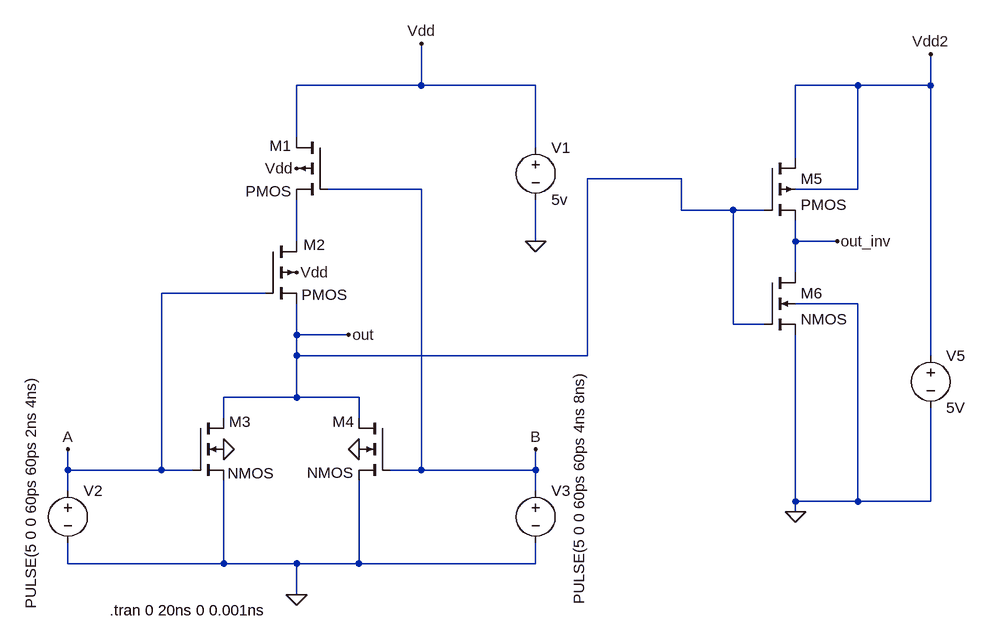
[diagram p0: schematic OR.asc]
OR.asc, the LTspice schematic file:
Version 4
SHEET 1 1400 752
WIRE 512 -80 512 -144
WIRE 512 -80 320 -80
WIRE 688 -80 512 -80
WIRE 1184 -80 1088 -80
WIRE 1296 -80 1296 -128
WIRE 1296 -80 1184 -80
WIRE 320 0 320 -80
WIRE 688 16 688 -80
WIRE 1088 32 1088 -80
WIRE 912 64 768 64
WIRE 512 80 368 80
WIRE 1184 80 1184 -80
WIRE 1184 80 1088 80
WIRE 912 112 912 64
WIRE 992 112 912 112
WIRE 1040 112 992 112
WIRE 320 160 320 96
WIRE 688 160 688 96
WIRE 1088 160 1088 128
WIRE 1152 160 1088 160
WIRE 1088 208 1088 160
WIRE 272 240 112 240
WIRE 1184 256 1088 256
WIRE 992 288 992 112
WIRE 1040 288 992 288
WIRE 320 304 320 256
WIRE 400 304 320 304
WIRE 320 336 320 304
WIRE 768 336 768 64
WIRE 768 336 320 336
WIRE 1296 336 1296 -80
WIRE 320 400 320 336
WIRE 320 400 208 400
WIRE 416 400 320 400
WIRE 208 432 208 400
WIRE 416 432 416 400
WIRE -32 512 -32 480
WIRE 112 512 112 240
WIRE 112 512 -32 512
WIRE 160 512 112 512
WIRE 512 512 512 80
WIRE 512 512 464 512
WIRE 688 512 688 480
WIRE 688 512 512 512
WIRE -32 544 -32 512
WIRE 688 544 688 512
WIRE 1088 560 1088 304
WIRE 1184 560 1184 256
WIRE 1184 560 1088 560
WIRE 1296 560 1296 416
WIRE 1296 560 1184 560
WIRE 1088 576 1088 560
WIRE -32 656 -32 624
WIRE 208 656 208 528
WIRE 208 656 -32 656
WIRE 320 656 208 656
WIRE 416 656 416 528
WIRE 416 656 320 656
WIRE 688 656 688 624
WIRE 688 656 416 656
WIRE 320 704 320 656
FLAG 320 704 0
FLAG 688 160 0
FLAG 512 -144 Vdd
FLAG 320 48 Vdd
FLAG 320 208 Vdd
FLAG 208 480 0
FLAG 416 480 0
FLAG -32 480 A
FLAG 688 480 B
FLAG 1088 576 0
FLAG 1296 -128 Vdd2
FLAG 1152 160 out_inv
FLAG 400 304 out
SYMBOL nmos4 160 432 R0
WINDOW 0 56 6 Left 2
WINDOW 3 54 85 Left 2
SYMATTR InstName M3
SYMATTR Value2 l=0.6u w=3u
SYMBOL nmos4 464 432 M0
WINDOW 0 55 6 Left 2
WINDOW 3 56 84 Left 2
SYMATTR InstName M4
SYMATTR Value2 l=0.6u w=3u
SYMBOL pmos4 272 160 R0
WINDOW 0 59 5 Left 2
WINDOW 3 56 82 Left 2
SYMATTR InstName M2
SYMATTR Value2 l=0.6u w=6u
SYMBOL pmos4 368 0 M0
WINDOW 0 56 13 Left 2
WINDOW 3 56 83 Left 2
SYMATTR InstName M1
SYMATTR Value2 l=0.6u w=6u
SYMBOL voltage 688 0 R0
WINDOW 123 0 0 Left 0
WINDOW 39 0 0 Left 0
SYMATTR InstName V1
SYMATTR Value 5v
SYMBOL voltage -32 528 R0
WINDOW 3 -57 -161 VRight 2
WINDOW 123 0 0 Left 0
WINDOW 39 0 0 Left 0
SYMATTR Value PULSE(5 0 0 60ps 60ps 2ns 4ns)
SYMATTR InstName V2
SYMBOL voltage 688 528 R0
WINDOW 3 67 -168 VRight 2
WINDOW 123 0 0 Left 0
WINDOW 39 0 0 Left 0
SYMATTR Value PULSE(5 0 0 60ps 60ps 4ns 8ns)
SYMATTR InstName V3
SYMBOL voltage 1296 320 R0
WINDOW 123 0 0 Left 0
WINDOW 39 0 0 Left 0
SYMATTR InstName V5
SYMATTR Value 5V
SYMBOL pmos4 1040 32 R0
SYMATTR InstName M5
SYMBOL nmos4 1040 208 R0
SYMATTR InstName M6
TEXT 32 728 Left 2 !.tran 0 20ns 0 0.001ns

The netlist it stands for:
* OR.asc
M3 out A 0 0 NMOS l=0.6u w=3u
M4 out B 0 0 NMOS l=0.6u w=3u
M2 N001 A out Vdd PMOS l=0.6u w=6u
M1 Vdd B N001 Vdd PMOS l=0.6u w=6u
V1 Vdd 0 5v
V2 A 0 PULSE(5 0 0 60ps 60ps 2ns 4ns)
V3 B 0 PULSE(5 0 0 60ps 60ps 4ns 8ns)
V5 Vdd2 0 5V
M5 Vdd2 out out_inv Vdd2 PMOS
M6 out_inv out 0 0 NMOS
.model NMOS NMOS
.model PMOS PMOS
.lib standard.mos
.tran 0 20ns 0 0.001ns
.backanno
.end